# Altium schematic sheet serial.SchDoc
size OrCAD A; DrawnBy: Van Tuan Ngo; Organization: PIF Club; Address1: HCMUT,; Address2: Ly Thuong Kiet St.,; Address3: District 10, HCM, VN; DocumentNumber: 4; Revision: 1.0.0; SheetNumber: 4; SheetTotal: 4; Project: RTLS
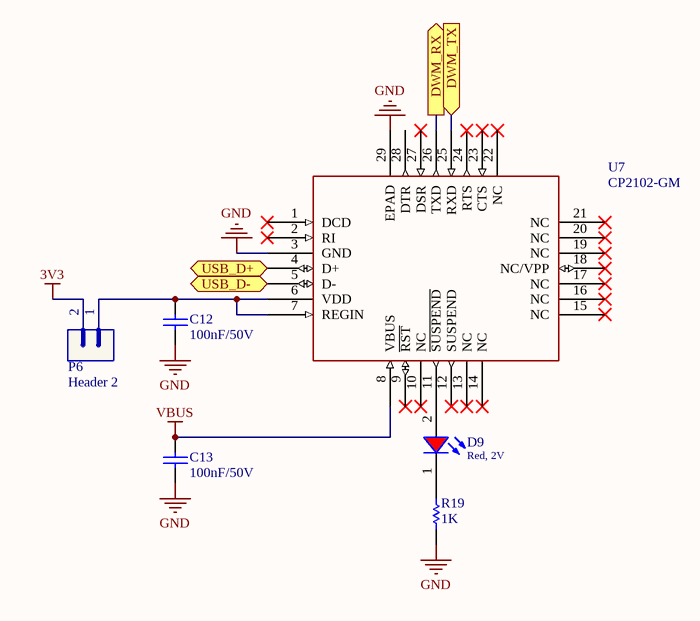
[diagram p0: serial.SchDoc]

## Parts
C12  value 100nF/50V  [CAP-SM-0805]  (hidden comment: Cap-100nF-50V-0805)
C13  value 100nF/50V  [CAP-SM-0805]  (hidden comment: Cap-100nF-50V-0805)
D9  Red, 2V  [WL-SMCW_0805]
P6  Header 2  [JP2]
R19  value 1K  [RES-SM-0805]  (hidden comment: Res-1K-0805)
U7  CP2102-GM  [QFN28_5X5_SIL]

## Ports
DWM_RX (out), DWM_TX (in), USB_D+ (bidir), USB_D- (bidir)

## Nets
3V3: P6.2
GND: C12.1 C13.1 R19.1 U7.3(GND) U7.29(EPAD)
VBUS: C13.2 U7.8(VBUS)
DWM_RX: U7.26(TXD) ; port DWM_RX
DWM_TX: U7.25(RXD) ; port DWM_TX
USB_D+: U7.4(D+) ; port USB_D+
USB_D-: U7.5(D-) ; port USB_D-
NetC12_2: C12.2 P6.1 U7.6(VDD) U7.7(REGIN)
NetD9_1: D9.1(K) R19.2
NetD9_2: D9.2(A) U7.11(~{SUSPEND})

Not connected (* = marked no-connect by the designer): U7 1(DCD)* 2(RI)* 9(~{RST})* 10(NC)* 12(SUSPEND)* 13(NC)* 14(NC)* 15(NC)* 16(NC)* 17(NC)* 18(NC/VPP)* 19(NC)* 20(NC)* 21(NC)* 22(NC)* 23(CTS)* 24(RTS)* 27(DSR)* 28(DTR)

## Notes on the sheet
- Project
- Revision
- Date
- Author
- Sheet
- Time
- of
- File

## Library data of the parts
C12 C13 = Cap-100nF-50V-0805: CAP CER 0.1UF 50V Y5V 0805; Manufacturer: Samsung Electro-Mechanics; Manufacturer Part Number: CL21F104ZBCNNNC; Local Supplier: thegioiic; Local Supplier Link: https://thegioiic.com/products/tu-100nf-0-1uf-50v-0805; Supplier 1: Digikey; Supplier 1 Part Number: 1276-1007-1-ND; Supplier 1 Link: https://www.digikey.com/product-detail/en/samsung-electro-mechanics/CL21F104ZBCNNNC/1276-1007-1-ND/3889093
D9 = 150080RS75000: WL-SMCW SMT Mono-color Chip LED Waterclear, size 0805, Red, 2V, 140deg; Chip Technology: AlInGaP; Dominant Wavelength typ.: 625nm; Luminous Intensity typ.: 150mcd; Peak Wavelength typ.: 630nm; Viewing Angle: 140deg; ComponentLink1Description: Manufacturer; ComponentLink1URL: http://www.we-online.de; ComponentLink2URL: https://www.we-online.com/catalog/datasheet/150080RS75000.pdf; ComponentLink2Description: Datasheet; Forward Voltage typ.: 2V; Emitting Color: Red; Mounting Technology: SMT; Operating Temperature: -40 to +85degC; Published Date: December 2019; Part Number: 150080RS75000; Packaging: Tape and Reel; Size: 0805; Publisher: Wurth Elektronik
P6 = Header 2: Header, 2-Pin; LatestRevisionDate: 17-Jul-2002; LatestRevisionNote: Re-released for DXP Platform.; Publisher: Altium Limited; Local Supplier: thegioiic; Local Supplier Part Number: x; Local Supplier Link: https://www.thegioiic.com/products/hang-rao-duc-don-2-54mm-40-chan-1-hang-cao-11-4mm-xuyen-lo
R19 = Res-1K-0805: RES 1K OHM 1% 1/4W 0805; Manufacturer: Stackpole Electronics Inc; Manufacturer Part Number: RNCP0805FTD1K00; Local Supplier: thegioiic; Local Supplier Link: https://www.thegioiic.com/products/dien-tro-1-kohm-0805-5; Supplier 1: Digikey; Supplier 1 Link: https://www.digikey.com/product-detail/en/stackpole-electronics-inc/RNCP0805FTD1K00/RNCP0805FTD1K00CT-ND/2240568; Supplier 1 Part Number: RNCP0805FTD1K00CT-ND
U7 = CP2102-GM: Vendor: Silicon Labs; Built_By: EMA_UL_Team; SourceLibrary: Silicon_Labs_2015-03-23; Manufacturer_Part_Number: CP2102-GM; Copyright: Copyright (C) 2018 Accelerated Designs. All rights reserved; RefDes: RefDes; Type: DEV; Local Supplier: thegioiic; Local Supplier Part Number: *; Local Supplier Link: https://www.thegioiic.com/products/cp2102